# Altium schematic sheet BACKPMAN20_CPU.SchDoc
size A3
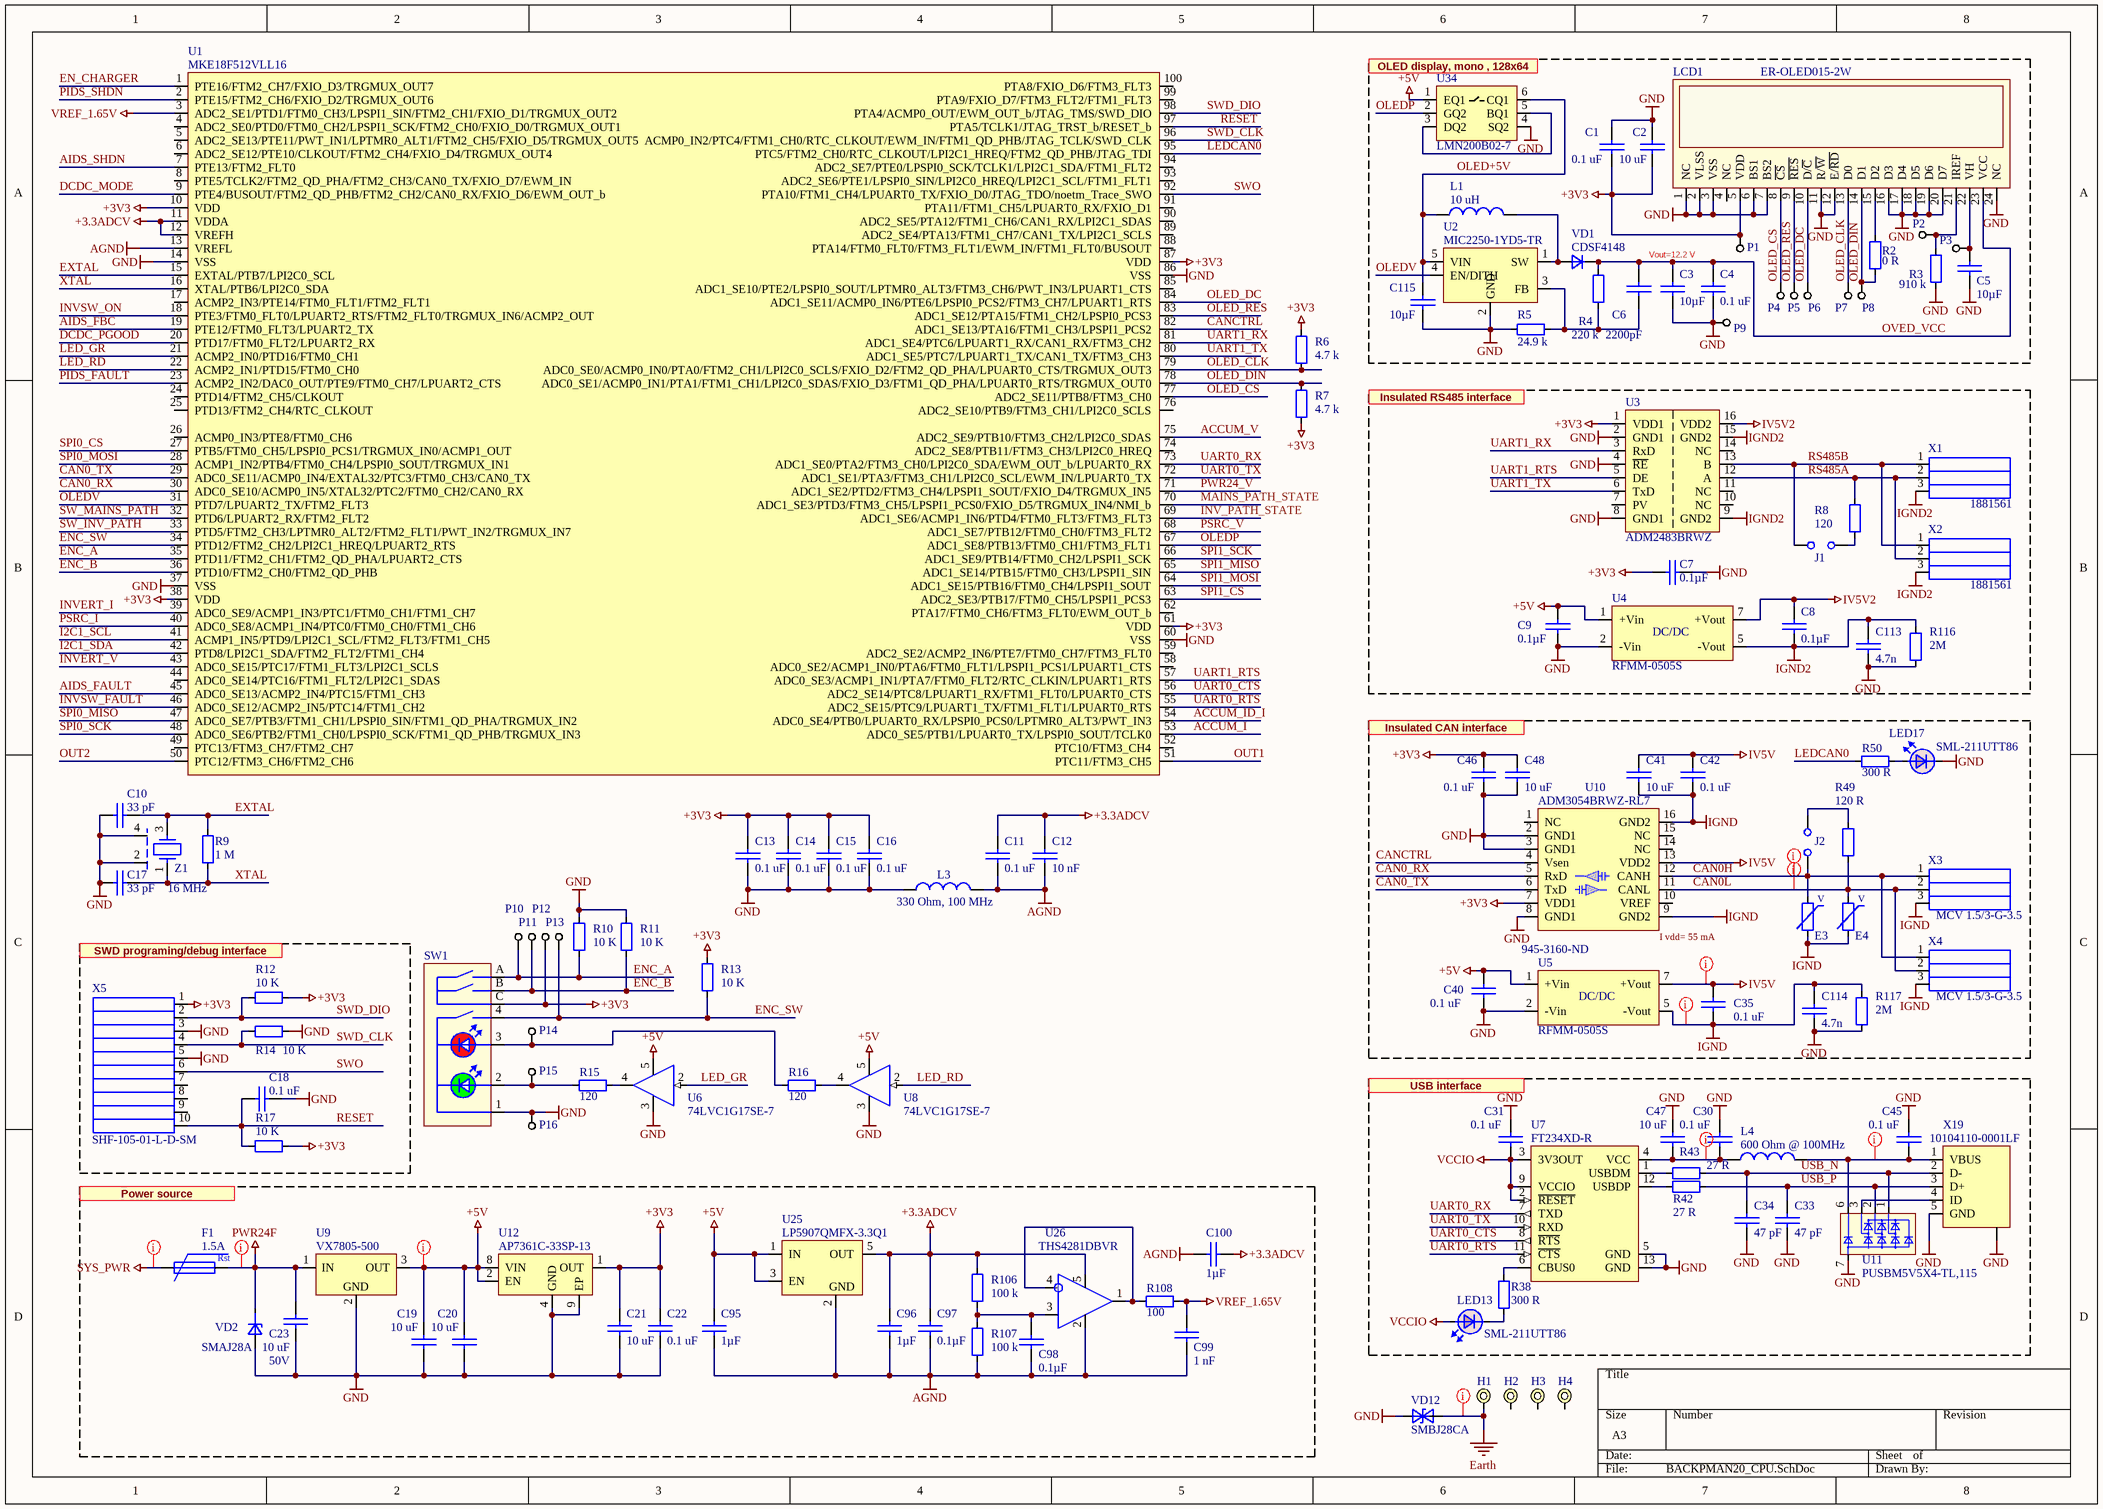
[diagram p0: BACKPMAN20_CPU.SchDoc]

## Parts
C1  value 0.1 uF  [1608[0603]]  (hidden comment: CL10B104KA8NNND)
C2  value 10 uF  [0805-1206]  (hidden comment: LMK212F106ZG-T)
C3  value 10µF  [0805 CAP]  (hidden comment: Capacitor)
C4  value 0.1 uF  [1608[0603]]  (hidden comment: CL10B104KA8NNND)
C5  value 10µF  [0805 CAP]  (hidden comment: Capacitor)
C6  value 2200pF  [0603 CAP]  (hidden comment: Capacitor)
C7  value 0.1µF  [0603 CAP]  (hidden comment: Capacitor)
C8  value 0.1µF  [0603 CAP]  (hidden comment: Capacitor)
C9  value 0.1µF  [0603 CAP]  (hidden comment: Capacitor)
C10  value 33 pF  [1005[0402]]  (hidden comment: CL05C330JB5NNNC)
C11  value 0.1 uF  [1608[0603]]  (hidden comment: CL10B104KA8NNND)
C12  value 10 nF  [1608[0603]]  (hidden comment: CVNF010K0603)
C13  value 0.1 uF  [1608[0603]]  (hidden comment: CL10B104KA8NNND)
C14  value 0.1 uF  [1608[0603]]  (hidden comment: CL10B104KA8NNND)
C15  value 0.1 uF  [1608[0603]]  (hidden comment: CL10B104KA8NNND)
C16  value 0.1 uF  [1608[0603]]  (hidden comment: CL10B104KA8NNND)
C17  value 33 pF  [1005[0402]]  (hidden comment: CL05C330JB5NNNC)
C18  value 0.1 uF  [1608[0603]]  (hidden comment: CL10B104KA8NNND)
C19  value 10 uF  [0805-1206]  (hidden comment: LMK212F106ZG-T)
C20  value 10 uF  [0805-1206]  (hidden comment: LMK212F106ZG-T)
C21  value 10 uF  [0805-1206]  (hidden comment: LMK212F106ZG-T)
C22  value 0.1 uF  [1608[0603]]  (hidden comment: CL10B104KA8NNND)
C23  value 10 uF  Voltage: 50V  [3225[1210]]  (hidden comment: GRM32DF51H106ZA01L)
C30  value 0.1 uF  [1608[0603]]  (hidden comment: CL10B104KA8NNND)
C31  value 0.1 uF  [1608[0603]]  (hidden comment: CL10B104KA8NNND)
C33  value 47 pF  [1608[0603]]  (hidden comment: C1608NP01H470J080AA)
C34  value 47 pF  [1608[0603]]  (hidden comment: C1608NP01H470J080AA)
C35  value 0.1 uF  [1608[0603]]  (hidden comment: CL10B104KA8NNND)
C40  value 0.1 uF  [1608[0603]]  (hidden comment: CL10B104KA8NNND)
C41  value 10 uF  [0805-1206]  (hidden comment: LMK212F106ZG-T)
C42  value 0.1 uF  [1608[0603]]  (hidden comment: CL10B104KA8NNND)
C45  value 0.1 uF  [1608[0603]]  (hidden comment: CL10B104KA8NNND)
C46  value 0.1 uF  [1608[0603]]  (hidden comment: CL10B104KA8NNND)
C47  value 10 uF  [0805-1206]  (hidden comment: GRM21BR60J106KE19L)
C48  value 10 uF  [0805-1206]  (hidden comment: LMK212F106ZG-T)
C95  value 1µF  [0603 CAP]  (hidden comment: Capacitor)
C96  value 1µF  [0603 CAP]  (hidden comment: Capacitor)
C97  value 0.1µF  [0603 CAP]  (hidden comment: Capacitor)
C98  value 0.1µF  [0603 CAP]  (hidden comment: Capacitor)
C99  value 1 nF  [0603 CAP]  (hidden comment: Capacitor)
C100  value 1µF  [0603 CAP]  (hidden comment: Capacitor)
C113  value 4.7n  [0805 CAP]  (hidden comment: C0805V472KDRACTU)
C114  value 4.7n  [0805 CAP]  (hidden comment: C0805V472KDRACTU)
C115  value 10µF  [0805 CAP]  (hidden comment: Capacitor)
E3  823 560 505 60  [0603]  (value not drawn)
E4  823 560 505 60  [0603]  (value not drawn)
F1  value 1.5A  [2920 (7351 Metric)]  (hidden comment: 0ZCF0075AF2C)
H1  Hole 5MM Plated  [HOLE_5MM plated]  (value not drawn)  (no BOM)
H2  Hole 5MM Plated  [HOLE_5MM plated]  (value not drawn)  (no BOM)
H3  Hole 5MM Plated  [HOLE_5MM plated]  (value not drawn)  (no BOM)
H4  Hole 5MM Plated  [HOLE_5MM plated]  (value not drawn)  (no BOM)
J1  PH1-02-TA-HT  [HDR1X2V]  (value not drawn)
J2  PH1-02-TA-HT  [HDR1X2V]  (value not drawn)
L1  value 10 uH  [VLS4012ET]  (hidden comment: VLS4012ET-100M)
L3  value 330 Ohm, 100 MHz  [0603]  (hidden comment: BLM18SG331TN1D)
L4  value 600 Ohm @ 100MHz  [0805]  (hidden comment: MPZ2012S601AT000)
LCD1  ER-OLED015-2W  [ER-OLED015-2]
LED13  SML-211UTT86  [0805 LED]
LED17  SML-211UTT86  [0805 LED]
P1  Pin 0.9 mm  [Pin 0.9 mm]  (value not drawn)  (net tie, no BOM)
P2  Pin 0.9 mm  [Pin 0.9 mm]  (value not drawn)  (net tie, no BOM)
P3  Pin 0.9 mm  [Pin 0.9 mm]  (value not drawn)  (net tie, no BOM)
P4  Pin 0.9 mm  [Pin 0.9 mm]  (value not drawn)  (net tie, no BOM)
P5  Pin 0.9 mm  [Pin 0.9 mm]  (value not drawn)  (net tie, no BOM)
P6  Pin 0.9 mm  [Pin 0.9 mm]  (value not drawn)  (net tie, no BOM)
P7  Pin 0.9 mm  [Pin 0.9 mm]  (value not drawn)  (net tie, no BOM)
P8  Pin 0.9 mm  [Pin 0.9 mm]  (value not drawn)  (net tie, no BOM)
P9  Pin 0.9 mm  [Pin 0.9 mm]  (value not drawn)  (net tie, no BOM)
P10  Pin 0.9 mm  [Pin 0.9 mm]  (value not drawn)  (net tie, no BOM)
P11  Pin 0.9 mm  [Pin 0.9 mm]  (value not drawn)  (net tie, no BOM)
P12  Pin 0.9 mm  [Pin 0.9 mm]  (value not drawn)  (net tie, no BOM)
P13  Pin 0.9 mm  [Pin 0.9 mm]  (value not drawn)  (net tie, no BOM)
P14  Pin 0.9 mm  [Pin 0.9 mm]  (value not drawn)  (net tie, no BOM)
P15  Pin 0.9 mm  [Pin 0.9 mm]  (value not drawn)  (net tie, no BOM)
P16  Pin 0.9 mm  [Pin 0.9 mm]  (value not drawn)  (net tie, no BOM)
R2  value 0 R  [0603]  (hidden comment: RC0603FR-070RL)
R3  value 910 k  [0603]  (hidden comment: Resistor)
R4  value 220 k  [0603]  (hidden comment: Resistor)
R5  value 24.9 k  [0603]  (hidden comment: Resistor)
R6  value 4.7 k  [0603]  (hidden comment: Resistor)
R7  value 4.7 k  [0603]  (hidden comment: Resistor)
R8  value 120  [0603]  (hidden comment: Resistor)
R9  value 1 M  [0402]  (hidden comment: RC0402FR-071ML)
R10  value 10 K  [0603]  (hidden comment: RL0603K010-1)
R11  value 10 K  [0603]  (hidden comment: RL0603K010-1)
R12  value 10 K  [0603]  (hidden comment: RL0603K010-1)
R13  value 10 K  [0603]  (hidden comment: RL0603K010-1)
R14  value 10 K  [0603]  (hidden comment: RL0603K010-1)
R15  value 120  [0603]  (hidden comment: Resistor)
R16  value 120  [0603]  (hidden comment: Resistor)
R17  value 10 K  [0603]  (hidden comment: RL0603K010-1)
R38  value 300 R  [0603]  (hidden comment: CRCW0603300RFKEA)
R42  value 27 R  [0603]  (hidden comment: RC0603FR-0727RL)
R43  value 27 R  [0603]  (hidden comment: RC0603FR-0727RL)
R49  value 120 R  [0603]  (hidden comment: RL0603E120-1)
R50  value 300 R  [0603]  (hidden comment: CRCW0603300RFKEA)
R106  value 100 k  [0603]  (hidden comment: Resistor)
R107  value 100 k  [0603]  (hidden comment: Resistor)
R108  value 100  [0603]  (hidden comment: Resistor)
R116  value 2M  [1206]  (hidden comment: RCV12062M00FKEA)
R117  value 2M  [1206]  (hidden comment: RCV12062M00FKEA)
SW1  PEL12D-4225S-S2024  [PEL12D-4225S-S2024]  (value not drawn)
U1  MKE18F512VLL16  [LQPF100]
U2  MIC2250-1YD5-TR  [SOT23-5]
U3  ADM2483BRWZ  [SO-G16/D10.4]
U4  RFMM-0505S  [Recom 7-SIP module]
U5  RFMM-0505S  Supplier Part Number 1: 945-3160-ND  [Recom 7-SIP module]
U6  74LVC1G17SE-7  [SOT-353 ON Semi]
U7  FT234XD-R  [FTDI DFN-12]
U8  74LVC1G17SE-7  [SOT-353 ON Semi]
U9  VX7805-500  [VX7805-500]
U10  ADM3054BRWZ-RL7  [SO-G16/D10.4]
U11  PUSBM5V5X4-TL,115  [DFN1616-6]
U12  AP7361C-33SP-13  [SOIC-8 EDP]
U25  LP5907QMFX-3.3Q1  [SOT23-5]
U26  THS4281DBVR  [SOT23-5]
U34  LMN200B02-7  [SOT363]
VD1  CDSF4148  [1005]
VD2  SMAJ28A  [SMA]
VD12  SMBJ28CA  [DO-214AA_SMBJ BI]
X1  1881561  [1881561]
X2  1881561  [1881561]
X3  MCV 1.5/3-G-3.5  [mcv1.5-3-g_3.5 green + MC 1,5 3-ST-3,5 - 1840379]
X4  MCV 1.5/3-G-3.5  [mcv1.5-3-g_3.5 green + MC 1,5 3-ST-3,5 - 1840379]
X5  SHF-105-01-L-D-SM  [SHF-105-01-L-D-SM]
X19  10104110-0001LF  [FCI micro USB B receptacle SMD]
Z1  value 16 MHz  [4-SMD 2.00mm x 1.60mm]  (hidden comment: ABM11-16.000MHZ-9-B1U-T)

## Blocks framed on the sheet
Vout=12.2 V: C1-C6 C115 L1 LCD1 P1-P9 R2-R5 U2 U34 VD1
I vdd= 55 mA: C35 C40-C42 C46 C48 C114 E3 E4 J2 LED17 R49 R50 R117 U5 U10 X3 X4

## Nets
+3.3ADCV: C11.2 C12.1 C96.2 C97.1 C100.1 R106.2 U1.11(VDDA) U1.12(VREFH) U25.5(OUT) U26.5(V+)
+3V3: C1.2 C2.1 C7.1 C13.2 C14.2 C15.2 C16.2 C21.2 C22.2 C46.2 C48.2 LCD1.5(VDD) P1.1 P12.1 R6.2 R7.1 R12.2 R13.2 R17.2 SW1.C U1.10(VDD) U1.38(VDD) U1.61(VDD) U1.87(VDD) U3.1(VDD1) U10.7(VDD1) U12.1(OUT) X5.1
+5V: C9.2 C19.2 C20.2 C40.2 C95.2 U4.1(+Vin) U5.1(+Vin) U6.5(VCC) U8.5(VCC) U9.3(OUT) U12.2(EN) U12.8(VIN) U25.1(IN) U25.3(EN) U34.1(EQ1)
AGND: C11.1 C12.2 C95.1 C96.1 C97.2 C98.2 C99.2 C100.2 L3.2 R107.1 U1.13(VREFL) U25.2(GND) U26.2(GND)
Earth: H1.0 VD12.2(A)
GND: C1.1 C2.2 C3.2 C4.1 C5.2 C7.2 C9.1 C10.2 C13.1 C14.1 C15.1 C16.1 C17.2 C18.1 C19.1 C20.1 C21.1 C22.1 C23.2 C30.2 C31.2 C33.2 C34.2 C40.1 C45.2 C46.1 C47.2 C48.1 C113.2 C114.2 C115.2 L3.1 LCD1.1(NC) LCD1.2(VLSS) LCD1.3(VSS) LCD1.6(BS1) LCD1.7(BS2) LCD1.11(R/~{W}) LCD1.12(E/~{RD}) LCD1.16(D3) LCD1.17(D4) LCD1.18(D5) LCD1.19(D6) LCD1.20(D7) LCD1.24(NC) LED17.2 P9.1 P16.1 R3.1 R5.2 R10.2 R11.2 R14.2 R116.1 R117.1 SW1.1 U1.14(VSS) U1.37(VSS) U1.60(VSS) U1.86(VSS) U2.2(GND) U3.2(GND1) U3.4(~{RE}) U3.8(GND1) U4.2(-Vin) U5.2(-Vin) U6.3(GND) U7.5(GND) U7.13(GND) U8.3(GND) U9.2(GND) U10.2(GND1) U10.3(GND1) U10.8(GND1) U11.7 U12.4(GND) U12.9(EP) U34.4(SQ2) VD2.2 VD12.1(C) X5.3 X5.5 X19.5(GND) X19.G1(CASE) Z1.2 Z1.4
IGND: C35.1 C41.1 C42.1 C114.1 E3.1 E4.1 R117.2 U5.5(-Vout) U10.9(GND2) U10.16(GND2) X3.3 X4.3
IGND2: C8.1 C113.1 R116.2 U3.9(GND2) U3.15(GND2) U4.5(-Vout) X1.3 X2.3
IV5V: C35.2 C41.2 C42.2 U5.7(+Vout) U10.13(VDD2)
IV5V2: C8.2 U3.16(VDD2) U4.7(+Vout)
PWR24F: C23.1 F1.2 U9.1(IN) VD2.1
SYS_PWR: F1.1
VCCIO: C31.1 LED13.1 U7.2(~{RESET}) U7.3(3V3OUT) U7.9(VCCIO)
VREF_1.65V: C99.1 R108.1 U1.3(ADC2_SE1/PTD1/FTM0_CH3/LPSPI1_SIN/FTM2_CH1/FXIO_D1/TRGMUX_OUT2)
ACCUM_I: U1.53(ADC0_SE5/PTB1/LPUART0_TX/LPSPI0_SOUT/TCLK0)
ACCUM_ID_I: U1.54(ADC0_SE4/PTB0/LPUART0_RX/LPSPI0_PCS0/LPTMR0_ALT3/PWT_IN3)
ACCUM_V: U1.75(ADC2_SE9/PTB10/FTM3_CH2/LPI2C0_SDAS)
AIDS_FAULT: U1.45(ADC0_SE13/ACMP2_IN4/PTC15/FTM1_CH3)
AIDS_FBC: U1.19(PTE12/FTM0_FLT3/LPUART2_TX)
AIDS_SHDN: U1.7(PTE13/FTM2_FLT0)
CAN0_RX: U1.30(ADC0_SE10/ACMP0_IN5/XTAL32/PTC2/FTM0_CH2/CAN0_RX) U10.5(RxD)
CAN0_TX: U1.29(ADC0_SE11/ACMP0_IN4/EXTAL32/PTC3/FTM0_CH3/CAN0_TX) U10.6(TxD)
CAN0H: E3.2 J2.2 U10.12(CANH) X3.1 X4.1
CAN0L: E4.2 R49.1 U10.11(CANL) X3.2 X4.2
CANCTRL: U1.82(ADC1_SE13/PTA16/FTM1_CH3/LPSPI1_PCS2) U10.4(Vsen)
DCDC_MODE: U1.9(PTE4/BUSOUT/FTM2_QD_PHB/FTM2_CH2/CAN0_RX/FXIO_D6/EWM_OUT_b)
DCDC_PGOOD: U1.20(PTD17/FTM0_FLT2/LPUART2_RX)
EN_CHARGER: U1.1(PTE16/FTM2_CH7/FXIO_D3/TRGMUX_OUT7)
ENC_A: P10.1 R10.1 SW1.A U1.35(PTD11/FTM2_CH1/FTM2_QD_PHA/LPUART2_CTS)
ENC_B: P11.1 R11.1 SW1.B U1.36(PTD10/FTM2_CH0/FTM2_QD_PHB)
ENC_SW: P13.1 R13.1 SW1.4 U1.34(PTD12/FTM2_CH2/LPI2C1_HREQ/LPUART2_RTS)
EXTAL: C10.1 R9.1 U1.15(EXTAL/PTB7/LPI2C0_SCL) Z1.3
I2C1_SCL: U1.41(ACMP1_IN5/PTD9/LPI2C1_SCL/FTM2_FLT3/FTM1_CH5)
I2C1_SDA: U1.42(PTD8/LPI2C1_SDA/FTM2_FLT2/FTM1_CH4)
INV_PATH_STATE: U1.69(ADC1_SE6/ACMP1_IN6/PTD4/FTM0_FLT3/FTM3_FLT3)
INVERT_I: U1.39(ADC0_SE9/ACMP1_IN3/PTC1/FTM0_CH1/FTM1_CH7)
INVERT_V: U1.43(ADC0_SE15/PTC17/FTM1_FLT3/LPI2C1_SCLS)
INVSW_FAULT: U1.46(ADC0_SE12/ACMP2_IN5/PTC14/FTM1_CH2)
INVSW_ON: U1.18(PTE3/FTM0_FLT0/LPUART2_RTS/FTM2_FLT0/TRGMUX_IN6/ACMP2_OUT)
LED_GR: U1.21(ACMP2_IN0/PTD16/FTM0_CH1) U6.2(A)
LED_RD: U1.22(ACMP2_IN1/PTD15/FTM0_CH0) U8.2(A)
LEDCAN0: R50.2 U1.95(PTC5/FTM2_CH0/RTC_CLKOUT/LPI2C1_HREQ/FTM2_QD_PHB/JTAG_TDI)
MAINS_PATH_STATE: U1.70(ADC1_SE3/PTD3/FTM3_CH5/LPSPI1_PCS0/FXIO_D5/TRGMUX_IN4/NMI_b)
OLED+5V: C115.1 L1.1 U2.5(VIN) U34.6(CQ1)
OLED_CLK: LCD1.13(D0) P7.1 R6.1 U1.79(ADC0_SE0/ACMP0_IN0/PTA0/FTM2_CH1/LPI2C0_SCLS/FXIO_D2/FTM2_QD_PHA/LPUART0_CTS/TRGMUX_OUT3)
OLED_CS: LCD1.8(~{CS}) P4.1 U1.77(ADC2_SE11/PTB8/FTM3_CH0)
OLED_DC: LCD1.10(D/~{C}) P6.1 U1.84(ADC1_SE11/ACMP0_IN6/PTE6/LPSPI0_PCS2/FTM3_CH7/LPUART1_RTS)
OLED_DIN: LCD1.14(D1) P8.1 R2.1 R7.2 U1.78(ADC0_SE1/ACMP0_IN1/PTA1/FTM1_CH1/LPI2C0_SDAS/FXIO_D3/FTM1_QD_PHA/LPUART0_RTS/TRGMUX_OUT0)
OLED_RES: LCD1.9(~{RES}) P5.1 U1.83(ADC1_SE12/PTA15/FTM1_CH2/LPSPI0_PCS3)
OLEDP: U1.67(ADC1_SE8/PTB13/FTM0_CH1/FTM3_FLT1) U34.2(GQ2)
OLEDV: U1.31(PTD7/LPUART2_TX/FTM2_FLT3) U2.4(EN/DITH)
OUT1: U1.51(PTC11/FTM3_CH5)
OUT2: U1.50(PTC12/FTM3_CH6/FTM2_CH6)
OVED_VCC: C3.1 C4.2 C6.1 LCD1.23(VCC) R4.2 VD1.1
PIDS_FAULT: U1.23(ACMP2_IN2/DAC0_OUT/PTE9/FTM0_CH7/LPUART2_CTS)
PIDS_SHDN: U1.2(PTE15/FTM2_CH6/FXIO_D2/TRGMUX_OUT6)
PSRC_I: U1.40(ADC0_SE8/ACMP1_IN4/PTC0/FTM0_CH0/FTM1_CH6)
PSRC_V: U1.68(ADC1_SE7/PTB12/FTM0_CH0/FTM3_FLT2)
PWR24_V: U1.71(ADC1_SE2/PTD2/FTM3_CH4/LPSPI1_SOUT/FXIO_D4/TRGMUX_IN5)
RESET: C18.2 R17.1 U1.97(PTA5/TCLK1/JTAG_TRST_b/RESET_b) X5.10
RS485A: R8.2 U3.12(A) X1.2 X2.2
RS485B: J1.1 U3.13(B) X1.1 X2.1
SPI0_CS: U1.27(PTB5/FTM0_CH5/LPSPI0_PCS1/TRGMUX_IN0/ACMP1_OUT)
SPI0_MISO: U1.47(ADC0_SE7/PTB3/FTM1_CH1/LPSPI0_SIN/FTM1_QD_PHA/TRGMUX_IN2)
SPI0_MOSI: U1.28(ACMP1_IN2/PTB4/FTM0_CH4/LPSPI0_SOUT/TRGMUX_IN1)
SPI0_SCK: U1.48(ADC0_SE6/PTB2/FTM1_CH0/LPSPI0_SCK/FTM1_QD_PHB/TRGMUX_IN3)
SPI1_CS: U1.63(ADC2_SE3/PTB17/FTM0_CH5/LPSPI1_PCS3)
SPI1_MISO: U1.65(ADC1_SE14/PTB15/FTM0_CH3/LPSPI1_SIN)
SPI1_MOSI: U1.64(ADC1_SE15/PTB16/FTM0_CH4/LPSPI1_SOUT)
SPI1_SCK: U1.66(ADC1_SE9/PTB14/FTM0_CH2/LPSPI1_SCK)
SW_INV_PATH: U1.33(PTD5/FTM2_CH3/LPTMR0_ALT2/FTM2_FLT1/PWT_IN2/TRGMUX_IN7)
SW_MAINS_PATH: U1.32(PTD6/LPUART2_RX/FTM2_FLT2)
SWD_CLK: R14.1 U1.96(ACMP0_IN2/PTC4/FTM1_CH0/RTC_CLKOUT/EWM_IN/FTM1_QD_PHB/JTAG_TCLK/SWD_CLK) X5.4
SWD_DIO: R12.1 U1.98(PTA4/ACMP0_OUT/EWM_OUT_b/JTAG_TMS/SWD_DIO) X5.2
SWO: U1.92(PTA10/FTM1_CH4/LPUART0_TX/FXIO_D0/JTAG_TDO/noetm_Trace_SWO) X5.6
UART0_CTS: U1.56(ADC2_SE14/PTC8/LPUART1_RX/FTM1_FLT0/LPUART0_CTS) U7.8(~{RTS})
UART0_RTS: U1.55(ADC2_SE15/PTC9/LPUART1_TX/FTM1_FLT1/LPUART0_RTS) U7.11(~{CTS})
UART0_RX: U1.73(ADC1_SE0/PTA2/FTM3_CH0/LPI2C0_SDA/EWM_OUT_b/LPUART0_RX) U7.7(TXD)
UART0_TX: U1.72(ADC1_SE1/PTA3/FTM3_CH1/LPI2C0_SCL/EWM_IN/LPUART0_TX) U7.10(RXD)
UART1_RTS: U1.57(ADC0_SE3/ACMP1_IN1/PTA7/FTM0_FLT2/RTC_CLKIN/LPUART1_RTS) U3.5(DE)
UART1_RX: U1.81(ADC1_SE4/PTC6/LPUART1_RX/CAN1_RX/FTM3_CH2) U3.3(RxD)
UART1_TX: U1.80(ADC1_SE5/PTC7/LPUART1_TX/CAN1_TX/FTM3_CH3) U3.6(TxD)
USB_N: C34.1 R43.2 U11.1 X19.2(D-)
USB_P: C33.1 R42.2 U11.2 X19.3(D+)
XTAL: C17.1 R9.2 U1.16(XTAL/PTB6/LPI2C0_SDA) Z1.1
NetC5_1: C5.1 LCD1.22(VH) P3.1
NetC6_2: C6.2 R4.1 R5.1 U2.3(FB)
NetC30_1: C30.1 C47.1 L4.2 U7.4(VCC)
NetC45_1: C45.1 L4.1 U11.6 X19.1(VBUS)
NetC98_1: C98.1 R106.1 R107.2 U26.3(IN+)
NetJ1_2: J1.2 R8.1
NetJ2_1: J2.1 R49.2
NetL1_2: L1.2 U2.1(SW) VD1.2
NetLCD1_15: LCD1.15(D2) R2.2
NetLCD1_21: LCD1.21(IREF) P2.1 R3.2
NetLED13_2: LED13.2 R38.1
NetLED17_1: LED17.1 R50.1
NetP14_1: P14.1 R16.2 SW1.3
NetP15_1: P15.1 R15.2 SW1.2
NetR15_1: R15.1 U6.4(Y)
NetR16_1: R16.1 U8.4(Y)
NetR38_2: R38.2 U7.6(CBUS0)
NetR42_1: R42.1 U7.12(USBDP)
NetR43_1: R43.1 U7.1(USBDM)
NetR108_2: R108.2 U26.1(OUT) U26.4(IN-)
NetU11_3: U11.3 X19.4(ID)
NetU34_3: U34.3(DQ2) U34.5(BQ1)

Not connected (* = marked no-connect by the designer): H2 0; H3 0; H4 0; LCD1 4(NC); U1 4(ADC2_SE0/PTD0/FTM0_CH2/LPSPI1_SCK/FTM2_CH0/FXIO_D0/TRGMUX_OUT1) 5(ADC2_SE13/PTE11/PWT_IN1/LPTMR0_ALT1/FTM2_CH5/FXIO_D5/TRGMUX_OUT5) 6(ADC2_SE12/PTE10/CLKOUT/FTM2_CH4/FXIO_D4/TRGMUX_OUT4) 8(PTE5/TCLK2/FTM2_QD_PHA/FTM2_CH3/CAN0_TX/FXIO_D7/EWM_IN) 17(ACMP2_IN3/PTE14/FTM0_FLT1/FTM2_FLT1) 24(PTD14/FTM2_CH5/CLKOUT) 25(PTD13/FTM2_CH4/RTC_CLKOUT) 26(ACMP0_IN3/PTE8/FTM0_CH6) 44(ADC0_SE14/PTC16/FTM1_FLT2/LPI2C1_SDAS) 49(PTC13/FTM3_CH7/FTM2_CH7) 52(PTC10/FTM3_CH4) 58(ADC0_SE2/ACMP1_IN0/PTA6/FTM0_FLT1/LPSPI1_PCS1/LPUART1_CTS) 59(ADC2_SE2/ACMP2_IN6/PTE7/FTM0_CH7/FTM3_FLT0) 62(PTA17/FTM0_CH6/FTM3_FLT0/EWM_OUT_b) 74(ADC2_SE8/PTB11/FTM3_CH3/LPI2C0_HREQ) 76(ADC2_SE10/PTB9/FTM3_CH1/LPI2C0_SCLS) 85(ADC1_SE10/PTE2/LPSPI0_SOUT/LPTMR0_ALT3/FTM3_CH6/PWT_IN3/LPUART1_CTS) 88(PTA14/FTM0_FLT0/FTM3_FLT1/EWM_IN/FTM1_FLT0/BUSOUT) 89(ADC2_SE4/PTA13/FTM1_CH7/CAN1_TX/LPI2C1_SCLS) 90(ADC2_SE5/PTA12/FTM1_CH6/CAN1_RX/LPI2C1_SDAS) 91(PTA11/FTM1_CH5/LPUART0_RX/FXIO_D1) 93(ADC2_SE6/PTE1/LPSPI0_SIN/LPI2C0_HREQ/LPI2C1_SCL/FTM1_FLT1) 94(ADC2_SE7/PTE0/LPSPI0_SCK/TCLK1/LPI2C1_SDA/FTM1_FLT2) 99(PTA9/FXIO_D7/FTM3_FLT2/FTM1_FLT3) 100(PTA8/FXIO_D6/FTM3_FLT3); U3 7(PV) 10(NC) 11(NC) 14(NC); U10 1(NC) 10(VREF) 14(NC) 15(NC); X5 7 8 9

## Layout directives
net class 24V: Earth, PWR24F, SYS_PWR
net class Isol: CAN0H, CAN0L, IGND, IV5V
net class 5V: +5V, NetC30_1, NetC45_1

## Notes on the sheet
- (near U34) OLED display, mono , 128x64
- Insulated RS485 interface
- Insulated CAN interface
- SWD programing/debug interface
- (near C31) USB interface
- Power source
- (in symbol 0ZCF0075AF2C) Rst
- (in symbol 823 560 501 01) V
- (in symbol RFMM-0505S) DC/DC

## Library data of the parts
C1 C4 C11 C13-C16 C18 C22 C30 C31 C35 C40 C42 C45 C46 = CVNF100K0603-25: 0.1 uF, 50V, 10% , X7R,  0603 SMD MLC Capacitor; Manufacturer: WALSIN; PartNum: 2496834; PartName: 0603B104K500CT; Tolerance: ±10%; Distributor: Farnell; Voltage: 50 V
C2 C19-C21 C41 C48 = LMK212F106ZG-T: CAP CER 10UF 10V 10% X5R 0805; Manufacturer: Taiyo Yuden; PartNum: 587-2668-1-ND; PartName: LMK212B7106KG-TD; Distributor: Digi-Key; Tolerance: 10%; Voltage: 10V
  C19-C21: Price: 0.102$
C3 C5 C115 = TMK212BBJ106KG-T: 10µF, ±10%, 25V, X5R, 0805 (2012 Metric), -55°C ~ 85°C, -, General Purpose; Manufacturer: Taiyo Yuden; PartNum: 587-2985-1-ND; Part Number: TMK212BBJ106KG-T; Distributor: Digi-Key; PartName: TMK212BBJ106KG-T; Price: 0.26000; Tolerance: ±10%; Voltage - Rated: 25V; Temperature Coefficient: X5R; Operating Temperature: -55°C ~ 85°C; Features: -; Package / Case: 0805 (2012 Metric)
C6 = CC0603KRX7R8BB222: 2200pF, ±10%, 25V, X7R, 0603 (1608 Metric), -55°C ~ 125°C, -, General Purpose; Manufacturer: Yageo; PartNum: 311-3653-1-ND; Part Number: CC0603KRX7R8BB222; Distributor: Digi-Key; PartName: CC0603KRX7R8BB222; Price: 0.01610; Tolerance: ±10%; Voltage - Rated: 25V; Temperature Coefficient: X7R; Operating Temperature: -55°C ~ 125°C; Features: -; Package / Case: 0603 (1608 Metric)
C7-C9 = CL10B104KO8NNNC: 0.1µF, ±10%, 16V, X7R, 0603 (1608 Metric), -55°C ~ 125°C, -, General Purpose; Manufacturer: Samsung Electro-Mechanics; PartNum: 1276-1005-1-ND; Voltage - Rated: 16V; Part Number: CL10B104KO8NNNC; Distributor: Digi-Key; PartName: CL10B104KO8NNNC; Price: 0.01480; Tolerance: ±10%; Temperature Coefficient: X7R; Operating Temperature: -55°C ~ 125°C; Features: -; Package / Case: 0603 (1608 Metric)
C10 C17 = CL05C330JB5NNNC: 33 pF, 5%, 50V, C0G, NP0,  -55°C..125°C, 0402; Manufacturer: Kemet; PartNum: 1276-1272-1-ND; Tolerance: 5%; Distributor: Digi-Key; PartName: CL05C330JB5NNNC; Voltage: 50 V
C12 = CVNF010K0603: 10 nF, 50V, 10%, X7R, 0603 SMD MLC Capacitor; Manufacturer: Murata Electronics; PartNum: 490-1512-1-ND; PartName: GRM188R71H103KA01D; Tolerance: ±10%; Distributor: Digi-Key; Voltage: 50 V
C23 = GRM32DF51H106ZA01L: 10uF, 50V, 20%, Y5V (F), 1210; Manufacturer: Taiyo Yuden; PartNum: 587-2225-2-ND; PartName: UMK325BJ106MM-T; Tolerance: 20%; Price: 0.16$; Distributor: Digi-Key
C33 C34 = C1608NP01H470J080AA: 47 pF, 50V, 5%, NP0 SMD, -55°C ~ 150°C, 0603; Manufacturer: TDK Corporation; PartNum: 445-14081-1-ND; Tolerance: 5%; Price: 0.04$; Distributor: Digi-Key; Voltage: 50 V; PartName: C1608NP01H470J080AA
C47 = GRM21BR60J106KE19L: 10 uF, 6.3V, X5R, 10%, 0805; Manufacturer: Murata; PartNum: 490-1717-1-ND; Distributor: Digi-Key; Price: 0.4$; Tolerance: 10%; Voltage: 6.3V; PartName: GRM21BR60J106KE19L
C95 C96 C100 = EMK107BJ105KA-T: 1µF, ±10%, 16V, X5R, 0603 (1608 Metric), -55°C ~ 85°C, -, General Purpose; Manufacturer: Taiyo Yuden; PartNum: 587-1251-1-ND; Voltage - Rated: 16V; Part Number: EMK107BJ105KA-T; Distributor: Digi-Key; PartName: EMK107BJ105KA-T; Price: 0.02330; Tolerance: ±10%; Temperature Coefficient: X5R; Operating Temperature: -55°C ~ 85°C; Features: -; Package / Case: 0603 (1608 Metric)
C97 C98 = GCM188L81H104KA57D: 0.1µF, ±10%, 50V, X8L, 0603 (1608 Metric), -55°C ~ 150°C, -, Automotive; Manufacturer: Murata Electronics North America; PartNum: 490-6049-1-ND; Voltage - Rated: 50V; Part Number: GCM188L81H104KA57D; Distributor: Digi-Key; PartName: GCM188L81H104KA57D; Price: 0.06240; Tolerance: ±10%; Temperature Coefficient: X8L; Operating Temperature: -55°C ~ 150°C; Features: -; Package / Case: 0603 (1608 Metric)
C99 = CC0603JRX7R9BB102: 1000pF, ±5%, 50V, X7R, 0603 (1608 Metric), -55°C ~ 125°C, -, General Purpose; Manufacturer: Yageo; PartNum: 311-3361-1-ND; Voltage - Rated: 50V; Part Number: CC0603JRX7R9BB102; Distributor: Digi-Key; PartName: CC0603JRX7R9BB102; Price: 0.01920; Tolerance: ±5%; Temperature Coefficient: X7R; Operating Temperature: -55°C ~ 125°C; Features: -; Package / Case: 0603 (1608 Metric)
C113 C114 = C0805V472KDRACTU: 4700pF ±10% 1000V (1kV) Ceramic Capacitor X7R 0805 (2012 Metric),-55°C ~ 125°C; Manufacturer: KEMET; PartNum: 399-6470-1-ND; Distributor: Digi-Key; Tolerance: 10%; PartName: C0805V472KDRACTU; Price: 0.3$; Voltage: 1000V
E3 E4 = 823 560 501 01: SUPPRESSOR ESD 5VDC, 56pF,  0603, -40..+85C; Manufacturer: Würth Elektronik; Voltage: 5V; Distributor: Würth Elektronik; PartNum: 823 560 505 60; PartName: 823 560 505 60
F1 = 0ZCF0075AF2C: PTC RESETTABLE 60V 750MA, It=1.5A, 0.3s 2920(7351); Manufacturer: Bel Fuse Inc.; PartNum: 507-1743-1-ND; Distributor: Digi-Key; PartName: 0ZCF0075AF2C
J1 J2 = Jumper: 2 Pos. 2.54 mm Single Row Through Hole Straight Pin Header; Manufacturer: ADAM TECH; Distributor: Future; Price: 0.02 Euro; PartNum: PH1-02-TA-HT; PartName: PH1-02-TA-HT
  J2: Price50: 0.02 Euro; Price100: 0.02 Euro; Price1000: 0.02 Euro
L1 = VLS4012ET-100M: 10uH, 890 mA, 0.228 Ohm, +-20%,- 40 C to + 105 C; Manufacturer: TDK Corporation; PartNum: 445-6681-1-ND; Tolerance: ±20%; Distributor: Mouser; PartName: VLS4012ET-100M
L3 = BLM18SG331TN1D: Ferrite bead, 330 Ohm, 100 MHz,  1.5 A, 0.07 Ohm; Manufacturer: Murata Electronics North America; Tolerance: 25%; Distributor: Future; Price: 0.03 Euro; PartNum: BLM18SG331TN1D; PartName: BLM18SG331TN1D
L4 = MPZ2012S601AT000: FERRITE BEAD 600 OHM, 0805, -55°C ~ 125°C; Manufacturer: TDK Corporation; PartNum: 445-2206-1-ND; Distributor: Digi-Key; Price: 0.05$; PartName: MPZ2012S601AT000
LCD1 = ER-OLED015-2W: 1.5"OLED Display Serial 128x64 Module,SSD1309,White on Black; Manufacturer: Orient Display; PartNum: 2544-AOM12864A0-1.54WW-ND; PartName: AOM12864A0-1.54WW; Distributor: Digi-Key
LED13 LED17 = SML-211UTT86: 0805 red LED, hibright, 2 mA, 1.8V, 130°; Manufacturer: Rohm; PartNum: 511-1292-1-ND; Distributor: Digi-Key; Price: 0.34$; Value: Red; PartName: SML-211UTT86
R2 = RC0603FR-070RL: 0 R, Jumper, 0603, SMD Resistor, -55°C ~ 155°C; Manufacturer: Yageo; PartNum: 311-0.0HRCT-ND; Voltage: 75 V; Distributor: Digi-Key; Price: 0.005$; PartName: RC0603FR-070RL
R3 = RMCF0603FT910K: 910 kOhms, ±1%, 0.1W, 1/10W, Thick Film, ±100ppm/°C, 0603 (1608 Metric), -55°C ~ 155°C, Automotive AEC-Q200; Manufacturer: Stackpole Electronics Inc.; PartNum: RMCF0603FT910KCT-ND; Voltage: 75V; Distributor: Digi-Key; Price: 0.00690; Tolerance: ±1%; PartName: RMCF0603FT910K; Part Number: RMCF0603FT910K; Temperature Coefficient: ±100ppm/°C; Operating Temperature: -55°C ~ 155°C; Power (Watts): 0.1W, 1/10W; Features: Automotive AEC-Q200; Package / Case: 0603 (1608 Metric)
R4 = RMCF0603FT220K: 220 kOhms, ±1%, 0.1W, 1/10W, Thick Film, ±100ppm/°C, 0603 (1608 Metric), -55°C ~ 155°C, Automotive AEC-Q200; Manufacturer: Stackpole Electronics Inc.; PartNum: RMCF0603FT220KCT-ND; Voltage: 75V; Distributor: Digi-Key; Price: 0.00690; Tolerance: ±1%; PartName: RMCF0603FT220K; Part Number: RMCF0603FT220K; Temperature Coefficient: ±100ppm/°C; Operating Temperature: -55°C ~ 155°C; Power (Watts): 0.1W, 1/10W; Features: Automotive AEC-Q200; Package / Case: 0603 (1608 Metric)
R5 = RMCF0603FT24K9: 24.9 kOhms, ±1%, 0.1W, 1/10W, Thick Film, ±100ppm/°C, 0603 (1608 Metric), -55°C ~ 155°C, Automotive AEC-Q200; Manufacturer: Stackpole Electronics Inc.; PartNum: RMCF0603FT24K9CT-ND; Voltage: 75V; Distributor: Digi-Key; Price: 0.00690; Tolerance: ±1%; PartName: RMCF0603FT24K9; Part Number: RMCF0603FT24K9; Temperature Coefficient: ±100ppm/°C; Operating Temperature: -55°C ~ 155°C; Power (Watts): 0.1W, 1/10W; Features: Automotive AEC-Q200; Package / Case: 0603 (1608 Metric)
R6 R7 = RMCF0603FT4K70: 4.7 kOhms, ±1%, 0.1W, 1/10W, Thick Film, ±100ppm/°C, 0603 (1608 Metric), -55°C ~ 155°C, Automotive AEC-Q200; Manufacturer: Stackpole Electronics Inc.; PartNum: RMCF0603FT4K70CT-ND; Voltage: 75V; Distributor: Digi-Key; Price: 0.00690; Tolerance: ±1%; PartName: RMCF0603FT4K70; Part Number: RMCF0603FT4K70; Temperature Coefficient: ±100ppm/°C; Operating Temperature: -55°C ~ 155°C; Power (Watts): 0.1W, 1/10W; Features: Automotive AEC-Q200; Package / Case: 0603 (1608 Metric)
R8 R15 R16 = RMCF0603FT120R: 120 Ohms, ±1%, 0.1W, 1/10W, Thick Film, ±100ppm/°C, 0603 (1608 Metric), -55°C ~ 155°C, Automotive AEC-Q200; Manufacturer: Stackpole Electronics Inc.; PartNum: RMCF0603FT120RCT-ND; Voltage: 75V; Distributor: Digi-Key; Price: 0.00690; Tolerance: ±1%; PartName: RMCF0603FT120R; Part Number: RMCF0603FT120R; Temperature Coefficient: ±100ppm/°C; Operating Temperature: -55°C ~ 155°C; Power (Watts): 0.1W, 1/10W; Features: Automotive AEC-Q200; Package / Case: 0603 (1608 Metric)
R9 = RC0402FR-071ML: 1 M,  ±1%, ±100ppm/°C, Thick Film, -55°C ~ 155°C, 0402; Manufacturer: Yageo; PartNum: 311-1.00MLRCT-ND; Distributor: Digi-Key; Tolerance: 1%; PartName: RC0402FR-071ML
R10-R14 R17 = RL0603K010-1: 10 K, 1%, 0603, SMD Resistor, Taped; Manufacturer: Vishay; Voltage: 75 V; Distributor: Schukat; Price: 0.002 Euro; Tolerance: 1%; PartNum: RL0603K010-1
R38 R50 = CRCW0603300RFKEA: 300 R, 1%, 0.1 W, 0603, SMD Resistor, Taped; Manufacturer: Vishay/Dale; PartNum: 541-300HDKR-ND; Voltage: 75 V; Distributor: DigiKey; Price: 0.017$; Tolerance: 1%; PartName: CRCW0603300RFKEA
R42 R43 = RC0603FR-0727RL: 27 R, 1%, 0603, SMD,  -55°C ~ 155°C; Manufacturer: Yageo; PartNum: 311-27.0HRCT-ND; Voltage: 75 V; Distributor: Digi-Key; Price: 0.002 Euro; Tolerance: 1%; PartName: RC0603FR-0727RL
R49 = RL0603E120-1: 120 R, 1%, 0603, SMD Resistor, Taped; Manufacturer: Vishay; Voltage: 75 V; Distributor: Schukat; Tolerance: ±1%; PartNum: RL0603E120; PartName: RL0603E120
R106 R107 = RT0603BRD07100KL: 100 kOhms, ±0.1%, 0.1W, 1/10W, Thin Film, ±25ppm/°C, 0603 (1608 Metric), -55°C ~ 155°C, -; Manufacturer: Yageo; PartNum: YAG1235CT-ND; Voltage: 75V; Distributor: Digi-Key; Price: 0.274; Tolerance: ±0.1%; PartName: RT0603BRD07100KL; Part Number: RT0603BRD07100KL; Temperature Coefficient: ±25ppm/°C; Operating Temperature: -55°C ~ 155°C; Power (Watts): 0.1W, 1/10W; Features: -; Package / Case: 0603 (1608 Metric)
R108 = RMCF0603FT100R: 100 Ohms, ±1%, 0.1W, 1/10W, Thick Film, ±100ppm/°C, 0603 (1608 Metric), -55°C ~ 155°C, Automotive AEC-Q200; Manufacturer: Stackpole Electronics Inc.; PartNum: RMCF0603FT100RCT-ND; Voltage: 75V; Distributor: Digi-Key; Price: 0.00690; Tolerance: ±1%; PartName: RMCF0603FT100R; Part Number: RMCF0603FT100R; Temperature Coefficient: ±100ppm/°C; Operating Temperature: -55°C ~ 155°C; Power (Watts): 0.1W, 1/10W; Features: Automotive AEC-Q200; Package / Case: 0603 (1608 Metric)
R116 R117 = RCV12062M00FKEA: 2 MOhms ±1% 0.25W, 1/4W Chip Resistor 1206 (3216 Metric) High Voltage Thick Film,-55°C ~ 155°C; Manufacturer: Vishay Dale; PartNum: BC2835CT-ND; Voltage: 2000V; Distributor: Digi-Key; Price: 0.29$; Tolerance: ±1%; PartName: RCV12062M00FKEA
SW1 = PEL12D-4225S-S2024: Rotary Encoder Mechanical 24 Quadrature (Incremental) Vertical; Manufacturer: Bourns Inc.; PartNum: PEL12D-4225S-S2024-ND; Distributor: Digi-Key; PartName: PEL12D-4225S-S2024; Price: 3.62$
U1 = MKE18F512VLL16: ARM® Cortex®-M4F Kinetis KE1xF Microcontroller IC 32-Bit 168MHz 512KB (512K x 8) FLASH, 64 KB SRAM, 100-LQFP (14x14), -40°C ~ 105°C; Manufacturer: NXP USA Inc.; PartNum: MKE18F512VLL16-ND; Distributor: Digi-Key; PartName: MKE18F512VLL16; Price: 7.93$
U2 = MIC2250-1YD5-TR: Boost DC/DC, 2.5..5.5 to 1.24..32V, 900vA, 2.5Mhz, SOT-23-5, -40..+125 C; PartNum: 576-3967-1-ND; Manufacturer: Microchip Technology; Distributor: Digi-Key; PartName: MIC2250-1YD5-TR; Supplier 1: Digi-Key; Supplier Part Number 1: 576-3967-1-ND
U3 = ADM2483BRWZ: RS422, RS485 Digital Isolator 2500Vrms 3 Channel 500kbps 25kV/µs CMTI 16-SOIC, -40°C ~ 85°C; Manufacturer: Analog Divices; PartNum: ADM2483BRWZ-ND; Distributor: Digi-Key; Price: 6.25$; PartName: ADM2483BRWZ
U4 = RFMM-0505S: 1W DC-DC Unregulated Single Output , 5V in, 5 V out,  200mA, 4 kV, -40°C ~ 85°C; Manufacturer: Recom Power; PartNum: 945-3160-ND; Price: 1.7$; Distributor: Digi-Key; PartName: RFMM-0505S
U5 = RFMM-0505S: 1W DC-DC Unregulated Single Output , 5V in, 5 V out,  200mA, 4 kV, -40°C ~ 85°C; Manufacturer: Recom Power; Price: 1.7$; Distributor: Digi-Key; PartNum: 945-3160-ND; PartName: RFMM-0505S; Supplier 1: Digi-Key
U6 U8 = 74LVC1G17SE-7: IC SGL SCHMITT BUFFER SOT353; Manufacturer: Diodes Incorporated; PartNum: 74LVC1G17SE-7CT-ND; Distributor: Digi-Key; PartName: 74LVC1G17SE-7
U7 = FT234XD: USB Bridge, USB to UART USB 2.0 UART Interface 12-DFN (3x3); Manufacturer: FTDI; PartNum: 768-1178-1-ND; Distributor: Digi-Key; PartName: FT234XD-R; Price: 1.97$
U9 = VX7805-500: Linear Regulator Replacement DC DC Converter 1 Output 5V 500mA 6.5V - 36V Input; Manufacturer: CUI Inc.; PartNum: 102-4244-ND; Distributor: Digi-Key; price: 2.7$; PartName: VX7805-500
U10 = ADM3054BRWZ-RL7: IC Isol TXRX CAN HS 16SOIC; Manufacturer: Analog Divices; PartNum: ADM3054BRWZ-RL7CT-ND; Distributor: Digi-Key; PartName: ADM3054BRWZ-RL7
U11 = PUSBM5V5X4-TL,115: TVS DIODE 5.5VWM 12VC 6HXSON; Manufacturer: NXP Semiconductors; PartNum: 568-10921-1-ND; Distributor: Digi-Key; PartName: PUSBM5V5X4-TL,115
U12 = AP7361C-33SP-13: LDO, 3.3 V, 1A, 0.36V@1A, Vin=6V max, -40..+85C, 8-SO-EP; PartNum: AP7361C-33SP-13DICT-ND; Manufacturer: Diodes Incorporated; Distributor: Digi-Key; Price: 0.56$; PartName: AP7361C-33SP-13
U25 = LP5907QMFX-3.3Q1: LDO 3.3 V, 250 mA, Vin < 5.5V, Iq < 12uA, -40..+125 C, SOT23-5; Manufacturer: Texas Instruments; PartNum: 296-40365-1-ND; Distributor: Digi-Key; PartName: LP5907QMFX-3.3Q1; Supplier 1: Digi-Key; Supplier Part Number 1: 296-40365-1-ND
U26 = THS4281DBVR: Voltage Feedback Amplifier 1 Circuit Rail-to-Rail SOT-23-5; Manufacturer: Texas Instruments; PartNum: 296-39224-1-ND; Distributor: Digi-Key; PartName: THS4281DBVR; Supplier 1: Digi-Key; Supplier Part Number 1: 296-39224-1-ND
U34 = LMN200B02-7: Transistor Load Switch PNP Pre-Biased, N-Channel Pre-Biased 50V PNP, 60V N-Channel 200mA PNP, 115mA N-Channel Surface Mount SOT-363; Manufacturer: Diodes Incorporated; PartNum: LMN200B02DICT-ND; Distributor: Digi-Key; Price: 0.49$; PartName: LMN200B02-7; Supplier 1: Digi-Key; Supplier Part Number 1: LMN200B02DICT-ND
VD1 = CDSF4148: 150 mA, 75V, 1005, 125 C; Manufacturer: Comchip Technology; PartNum: 641-1004-1-ND; Distributor: Digi-Key; Price: 0.23$; PartName: CDSF4148
VD2 = SMAJ28A: DIODE TVS 28V 400W UNI 5% SMD; Manufacturer: Bourns Inc.; PartNum: SMAJ28ABCT-ND; Distributor: Digi-Key; Price: 0.18$; PartName: SMAJ28A; Value: 28 V
VD12 = SMBJ28CA: TVS 600W 28V Bidirectional; Manufacturer: Littelfuse; PartNum: SMBJ28CABCT-ND; Distributor: DigiKey; Price: 0.38$
X1 X2 = 1881561: Printed-circuit board connector - MCV 0,5/ 3-G-2,5 - 1881561; Manufacturer: Phoenix Contact; Distributor: Phoenix Contact; Price: 0.33; PartNum: 1881561; PartName: MCV 0,5/ 3-G-2,5
X3 X4 = MCV 1.5/3-G-3.5: HEADER, VERTICAL, 3.5MM, 3WAY; Manufacturer: PHOENIX CONTACT; PartNum: 1843619; PartName: MCV 1,5/3-G-3,5; Distributor: Farnell
X5 = SHF-105-01-L-D-SM: 10 Positions Header Connector 0.050" (1.27mm) Surface Mount Gold; Manufacturer: Samtec Inc.; PartName: SHF-105-01-L-D-SM
X19 = 10104110-0001LF: USB - micro B USB 2.0 Receptacle Connector 5 Position Surface Mount, Right Angle; Manufacturer: Amphenol FCI; PartNum: 609-4052-1-ND; Distributor: Digi-Key; Price: 0.79$; PartName: 10104110-0001LF
Z1 = ABM11-16.000MHZ-9-B1U-T: 16 MHz, 9 pF, ±10ppm, 2.00mm x 1.60mm, -20°C ~ 70°C; Manufacturer: Abracon LLC; PartNum: 535-13598-1-ND; Price: 0.98 $; Distributor: Digi-Key; Tolerance: 10 ppm; PartName: ABM11-16.000MHZ-9-B1U-T
P1-P16 = Pin 0.9 mm: PartName: Pin 0.9 mm